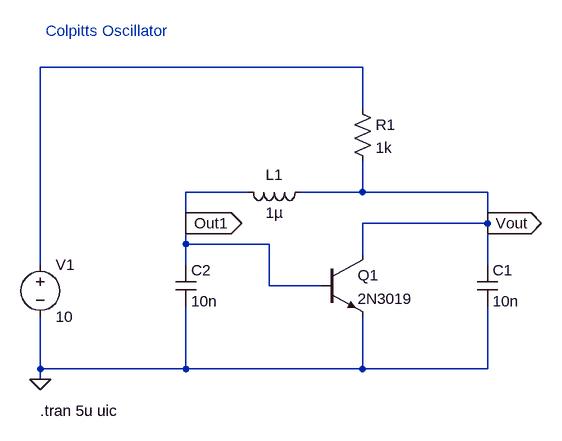
[diagram p0: schematic COLPITTS.asc]
COLPITTS.asc, the LTspice schematic file:
Version 4.1
SHEET 1 880 680
WIRE 464 -144 -32 -144
WIRE 464 -80 464 -144
WIRE 288 48 192 48
WIRE 464 48 464 0
WIRE 464 48 368 48
WIRE 656 48 464 48
WIRE 192 96 192 48
WIRE 656 96 656 48
WIRE 656 96 464 96
WIRE 192 128 192 96
WIRE 320 128 192 128
WIRE 464 144 464 96
WIRE -32 160 -32 -144
WIRE 192 160 192 128
WIRE 656 160 656 96
WIRE 320 192 320 128
WIRE 400 192 320 192
WIRE -32 320 -32 240
WIRE 192 320 192 224
WIRE 192 320 -32 320
WIRE 464 320 464 240
WIRE 464 320 192 320
WIRE 656 320 656 224
WIRE 656 320 464 320
WIRE -32 336 -32 320
FLAG -32 336 0
FLAG 656 96 Vout
IOPIN 656 96 Out
FLAG 192 96 Out1
IOPIN 192 96 Out
SYMBOL voltage -32 144 R0
WINDOW 123 0 0 Left 0
WINDOW 39 24 124 Left 2
SYMATTR InstName V1
SYMATTR Value 10
SYMBOL npn 400 144 R0
SYMATTR InstName Q1
SYMATTR Value 2N3019
SYMBOL cap 640 160 R0
SYMATTR InstName C1
SYMATTR Value 10n
SYMBOL cap 176 160 R0
SYMATTR InstName C2
SYMATTR Value 10n
SYMBOL ind 384 32 R90
WINDOW 0 5 56 VBottom 2
WINDOW 3 32 56 VTop 2
SYMATTR InstName L1
SYMATTR Value 1µ
SYMBOL res 448 -96 R0
SYMATTR InstName R1
SYMATTR Value 1k
TEXT -24 -200 Left 2 ;Colpitts Oscillator
TEXT -32 384 Left 2 !.tran 5u uic

The netlist it stands for:
* COLPITTS.asc
V1 N001 0 10
Q1 Vout Out1 0 0 2N3019
C1 Vout 0 10n
C2 Out1 0 10n
L1 Vout Out1 1µ
R1 N001 Vout 1k
.model NPN NPN
.model PNP PNP
.lib standard.bjt
* Colpitts Oscillator
.tran 5u uic
.backanno
.end